# Altium schematic sheet RF_2.SchDoc: uSDR schematic
size Letter; Author: Ye-sheng Kuo; CompanyName: Univ. of Michigan; Revision: 2.0; SheetNumber: 6; SheetTotal: 16
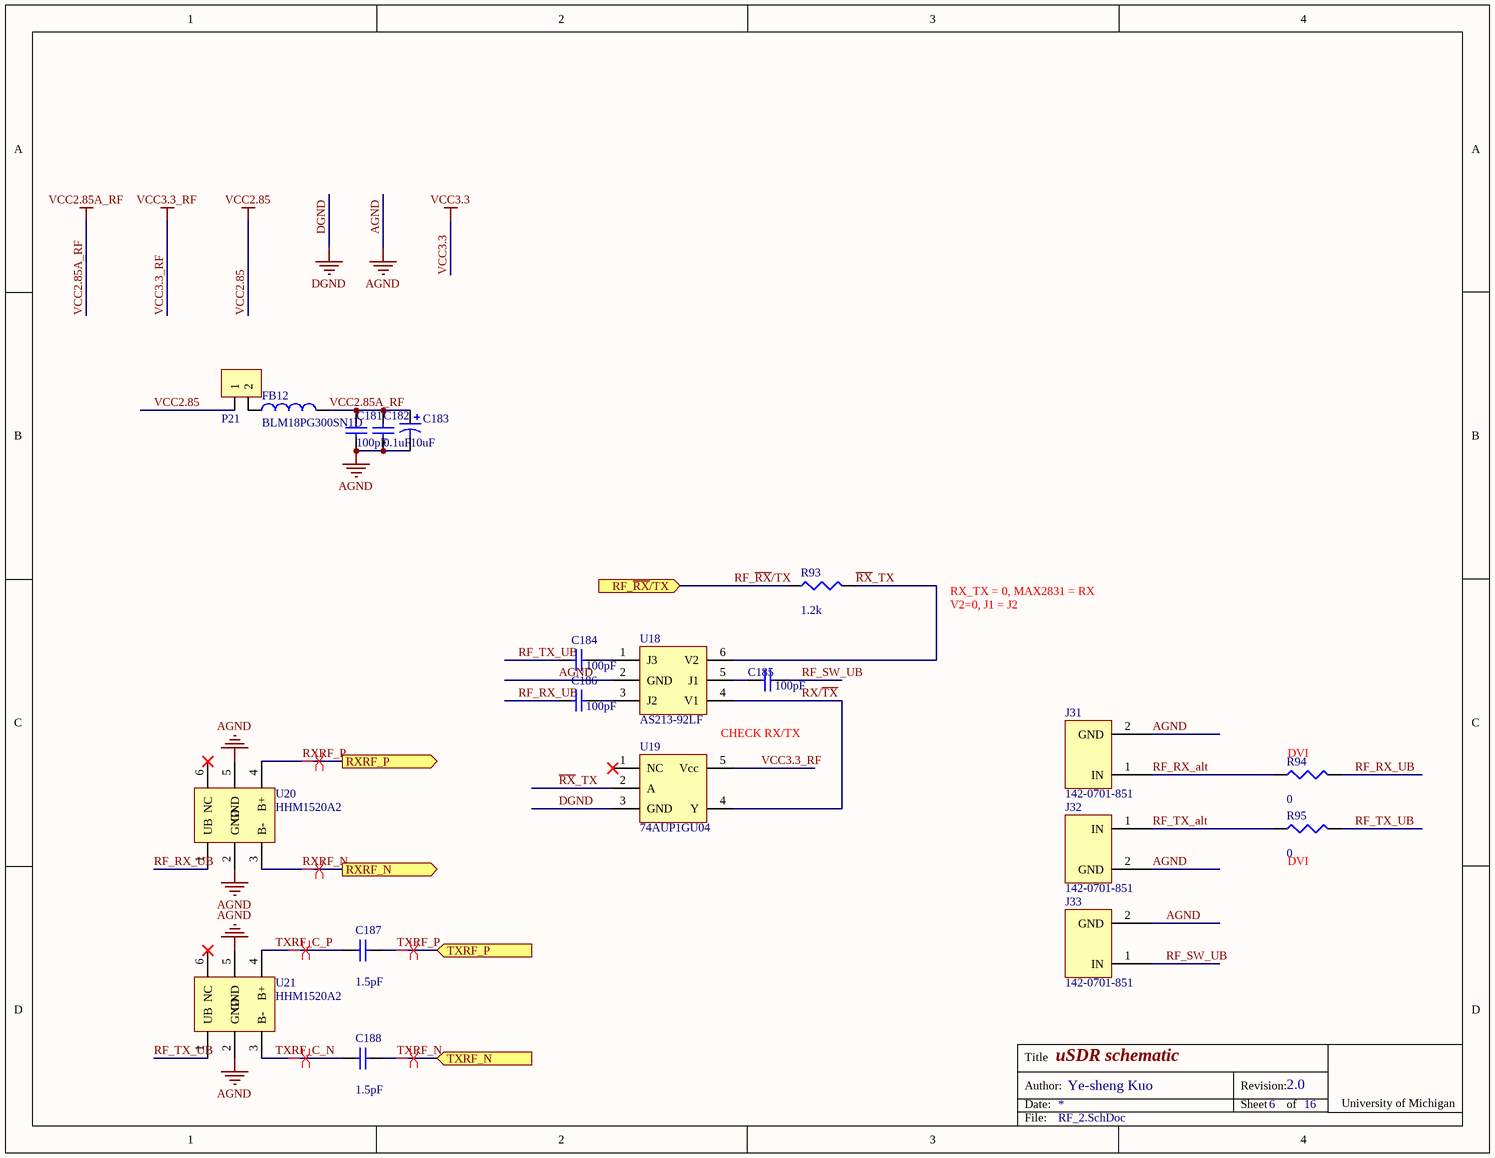
[diagram p0: RF_2.SchDoc]

## Parts
C181  100pF  [0402]
C182  0.1uF  [0402]
C183  10uF  [C0805]
C184  100pF  [0402]
C185  100pF  [0402]
C186  100pF  [0402]
C187  1.5pF  [0402]
C188  1.5pF  [0402]
FB12  BLM18PG300SN1D  [1608[0603]]
J31  142-0701-851  [SMA_SMD]
J32  142-0701-851  [SMA_SMD]
J33  142-0701-851  [SMA_SMD]
P21  1 x 2 header  [1x2 header]  (value not drawn)
R93  1.2K  [0402]
R94  0  [0402]
R95  0  [0402]
U18  AS213-92LF  [SOT363-6N]
U19  74AUP1GU04  [SOT353-5N]
U20  HHM1520A2  [HHM1520A2]
U21  HHM1520A2  [HHM1520A2]

## Ports
RF_~{RX}/TX (in), RXRF_N (out), RXRF_P (out), TXRF_N (in), TXRF_P (in)

## Nets
AGND: C181.1 C182.1 C183.2 J31.2(GND) J32.2(GND) J33.2(GND) U18.2(GND) U20.2(GND) U20.5(GND) U21.2(GND) U21.5(GND)
DGND: U19.3(GND)
VCC2.85: P21.1
VCC2.85A_RF: C181.2 C182.2 C183.1 FB12.2
VCC3.3_RF: U19.5(Vcc)
~{RX}_TX: R93.2 U18.6(V2) U19.2(A)
RF_~{RX}/TX: R93.1 ; port RF_~{RX}/TX
RF_RX_alt: J31.1(IN) R94.1
RF_RX_UB: C186.2 R94.2 U20.1(UB)
RF_SW_UB: C185.1 J33.1(IN)
RF_TX_alt: J32.1(IN) R95.1
RF_TX_UB: C184.2 R95.2 U21.1(UB)
RX/~{TX}: U18.4(V1) U19.4(Y)
RXRF_N: U20.3(B-) ; port RXRF_N
RXRF_P: U20.4(B+) ; port RXRF_P
TXRF_C_N: C188.2 U21.3(B-)
TXRF_C_P: C187.2 U21.4(B+)
TXRF_N: C188.1 ; port TXRF_N
TXRF_P: C187.1 ; port TXRF_P
NetC184_1: C184.1 U18.1(J3)
NetC185_2: C185.2 U18.5(J1)
NetC186_1: C186.1 U18.3(J2)
NetFB12_1: FB12.1 P21.2

Not connected (* = marked no-connect by the designer): U19 1(NC)*; U20 6(NC)*; U21 6(NC)*

## Layout directives
differential pair: RXRF_N, RXRF_P, TXRF_C_N, TXRF_C_P, TXRF_N, TXRF_P

## Notes on the sheet
- RX_TX = 0, MAX2831 = RX
- V2=0, J1 = J2
- CHECK RX/TX
- (near R94) DVI
- (near R95) DVI
- Title
- Date:
- Author:
- Revision:
- Sheet
- of
- University of Michigan
- File:

## Library data of the parts
C181 C182 C184-C188 = Cap Semi: Capacitor (Semiconductor SIM Model); Published: 8-Jun-2000; LatestRevisionDate: 29-May-2009; LatestRevisionNote: IPC-7351 Footprint Added.; PackageReference: C1206; Publisher: Altium Limited; PackageDescription: Chip Capacitor
  C181 C184-C186: Value: 100pF
  C182: Value: 0.1uF
  C187 C188: Value: 1.5pF
C183 = Cap Pol3: Polarized Capacitor (Surface Mount); Published: 8-Jun-2000; LatestRevisionDate: 29-May-2009; LatestRevisionNote: IPC-7351 Footprint Added.; PackageReference: C0805; Publisher: Altium Limited; PackageDescription: Chip Capacitor; Value: 10uF
FB12 = Ferrite Bead: FERRITE CHIP 30 OHM 1000MA 0603; Supplier 1: Digi-Key; Supplier Part Number 1: 490-1035-2-ND
J31-J33 = SMA_connector: CONN JACK END LAUNCH PC GOLD SMA; Supplier 1: Digi-Key; Supplier Part Number 1: J658-ND
P21 = 1 x 2 header: 100 mils standard header
R93-R95 = Res3: Resistor; Published: 8-Jun-2000; LatestRevisionDate: 29-May-2009; LatestRevisionNote: IPC-7351 Footprint Added.; PackageReference: J1-0603; Publisher: Altium Limited; PackageDescription: Chip Resistor
  R93: Value: 1.2k
  R94 R95: Value: 0
U18 = AS213-92LF: IC SW SPDT 0.1-3GHZ GAAS SC88; Supplier 1: Digi-Key; Supplier Part Number 1: 863-1238-1-ND; datasheet: http://www.skyworksinc.com/uploads/documents/200193D.pdf
U19 = 74AUP1GU04: IC UNBUFFERED INVERTER LP 5TSSOP; Supplier 1: Digi-Key; Supplier Part Number 1: 568-2573-1-ND; Datasheet: http://www.nxp.com/documents/data_sheet/74AUP1GU04.pdf
U20 U21 = TDK chip Balun: XFRMR BALUN RF 2.4GHZ SMD; Supplier 1: Digi-Key; Supplier Part Number 1: 445-3985-1-ND